# Altium schematic sheet LP55231 LED DRIVER.SchDoc
size A4; SheetNumber: 4; SheetTotal: 4
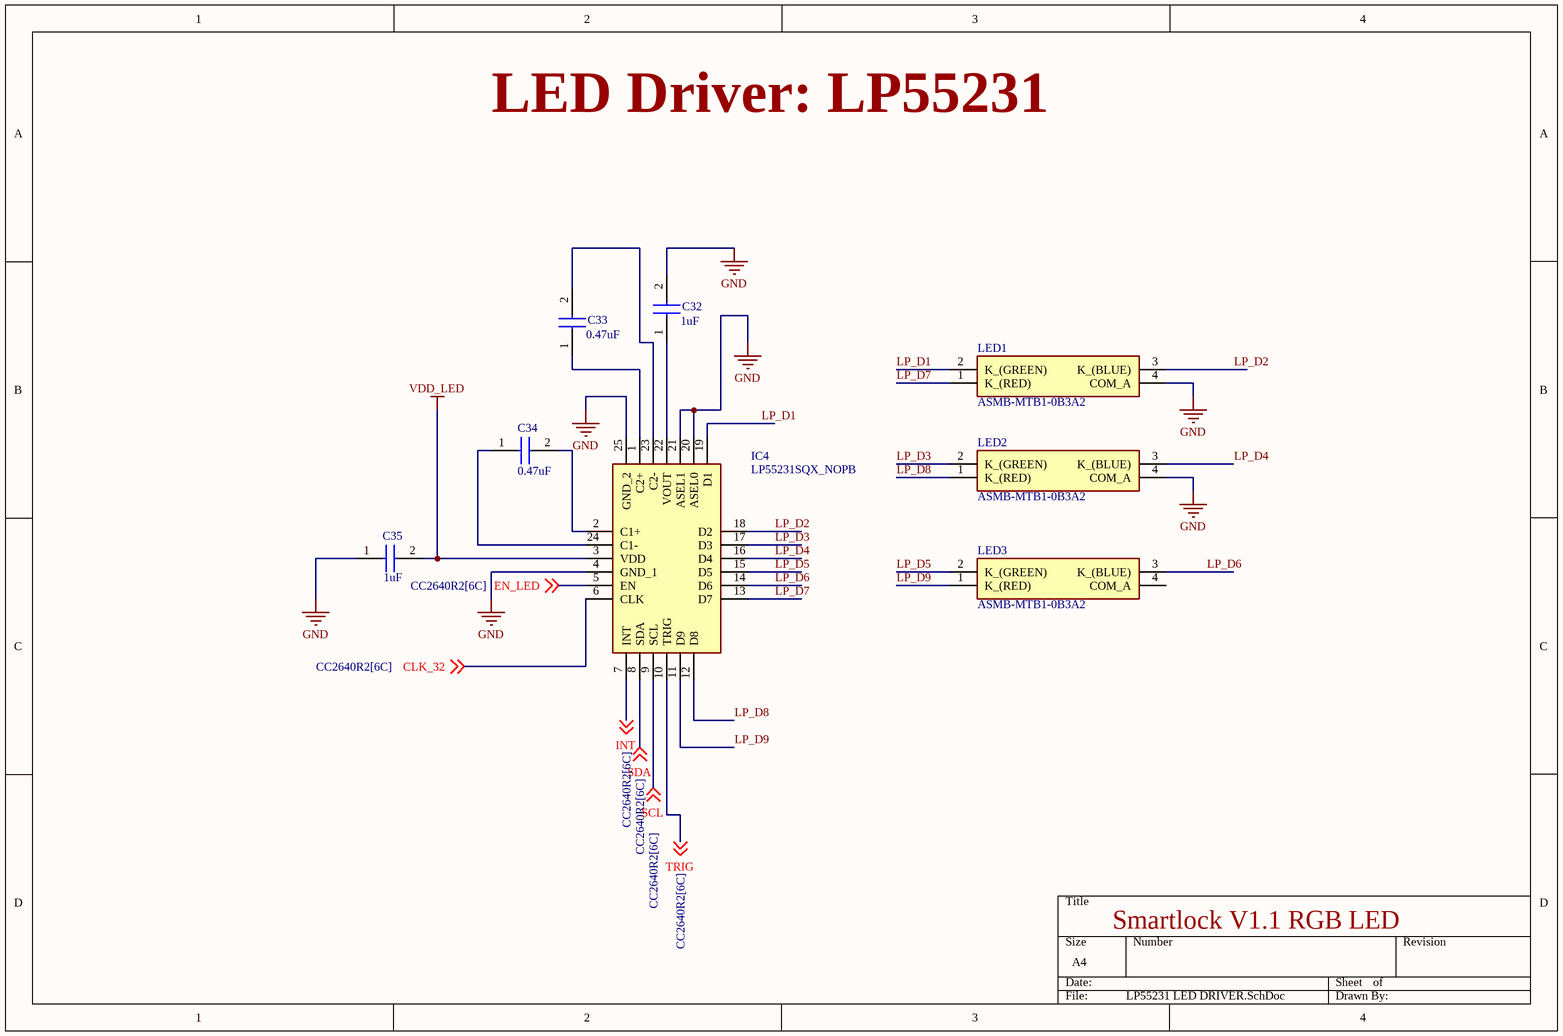
[diagram p0: LP55231 LED DRIVER.SchDoc]

## Parts
C32  1uF  [CAPC1005X55N]
C33  0.47uF  [CAPC1005X55N]
C34  0.47uF  [CAPC1005X55N]
C35  1uF  [CAPC1005X55N]
IC4  LP55231SQX_NOPB  [QFN50P400X400X80-25N]
LED1  ASMB-MTB1-0B3A2  [ASMBMTB10B3A2]
LED2  ASMB-MTB1-0B3A2  [ASMBMTB10B3A2]
LED3  ASMB-MTB1-0B3A2  [ASMBMTB10B3A2]

## Nets
GND: C32.2 C35.1 IC4.4(GND_1) IC4.20(ASEL0) IC4.21(ASEL1) IC4.25(GND_2) LED1.4(COM_A) LED2.4(COM_A)
VDD_LED: C35.2 IC4.3(VDD)
CLK_32: IC4.6(CLK) ; off-sheet CLK_32
EN_LED: IC4.5(EN) ; off-sheet EN_LED
INT: IC4.7(INT) ; off-sheet INT
LP_D1: IC4.19(D1) LED1.2(K_(GREEN))
LP_D2: IC4.18(D2) LED1.3(K_(BLUE))
LP_D3: IC4.17(D3) LED2.2(K_(GREEN))
LP_D4: IC4.16(D4) LED2.3(K_(BLUE))
LP_D5: IC4.15(D5) LED3.2(K_(GREEN))
LP_D6: IC4.14(D6) LED3.3(K_(BLUE))
LP_D7: IC4.13(D7) LED1.1(K_(RED))
LP_D8: IC4.12(D8) LED2.1(K_(RED))
LP_D9: IC4.11(D9) LED3.1(K_(RED))
SCL: IC4.9(SCL) ; off-sheet SCL
SDA: IC4.8(SDA) ; off-sheet SDA
TRIG: IC4.10(TRIG) ; off-sheet TRIG
NetC32_1: C32.1 IC4.22(VOUT)
NetC33_1: C33.1 IC4.1(C2+)
NetC33_2: C33.2 IC4.23(C2-)
NetC34_1: C34.1 IC4.24(C1-)
NetC34_2: C34.2 IC4.2(C1+)

Not connected (* = marked no-connect by the designer): LED3 4(COM_A)

## Notes on the sheet
- LED Driver: LP55231
- Smartlock V1.1 RGB LED

## Library data of the parts
C32 = GRM155R61A105KE15D: Capacitor 1uF 10V; Manufacturer_Name: Murata Electronics; Datasheet Link: http://www.murata.com/~/media/webrenewal/support/library/catalog/products/capacitor/mlcc/c02e.pdf; Height: 0.55mm; Manufacturer_Part_Number: GRM155R61A105KE15D; Mouser Part Number: 81-GRM155R61A105KE15; Mouser Price/Stock: https://www.mouser.co.uk/ProductDetail/Murata-Electronics/GRM155R61A105KE15D?qs=mjAxHPhY7UcmPekRqw%2FAPA%3D%3D; Arrow Part Number: GRM155R61A105KE15D; Arrow Price/Stock: https://www.arrow.com/en/products/grm155r61a105ke15d/murata-manufacturing?region=europe
C33 C34 = C1005X5R1A474K050BB: Capacitor 0.47uF 10V X5R; Manufacturer_Name: TDK; Datasheet Link: https://product.tdk.com/info/en/catalog/datasheets/mlcc_commercial_midvoltage_en.pdf; Height: 0.55mm; Manufacturer_Part_Number: C1005X5R1A474K050BB; Mouser Part Number: 810-C1005X5R1A474K; Mouser Price/Stock: https://www.mouser.com/Search/Refine.aspx?Keyword=810-C1005X5R1A474K
C35 = GRM155R61A105KE15D: Capacitor 1uF 10V X5R; Manufacturer_Name: Murata Electronics; Datasheet Link: http://www.murata.com/~/media/webrenewal/support/library/catalog/products/capacitor/mlcc/c02e.pdf; Height: 0.55mm; Manufacturer_Part_Number: GRM155R61A105KE15D; Mouser Part Number: 81-GRM155R61A105KE15; Mouser Price/Stock: https://www.mouser.co.uk/ProductDetail/Murata-Electronics/GRM155R61A105KE15D?qs=mjAxHPhY7UcmPekRqw%2FAPA%3D%3D; Arrow Part Number: GRM155R61A105KE15D; Arrow Price/Stock: https://www.arrow.com/en/products/grm155r61a105ke15d/murata-manufacturing?region=europe
IC4 = LP55231SQX_NOPB: Integrated Circuit; Manufacturer_Name: Texas Instruments; Manufacturer_Part_Number: LP55231SQX/NOPB; Datasheet Link: http://www.ti.com/lit/gpn/lp55231; Height: 0.8mm; Mouser Part Number: 595-LP55231SQX/NOPB; Mouser Price/Stock: https://www.mouser.co.uk/ProductDetail/Texas-Instruments/LP55231SQX-NOPB?qs=HF2YfZwisE8IcIRPR19gTw%3D%3D; Arrow Part Number: LP55231SQX/NOPB; Arrow Price/Stock: https://www.arrow.com/en/products/lp55231sqxnopb/texas-instruments?region=nac
LED1-LED3 = ASMB-MTB1-0B3A2: LED; Manufacturer_Name: Avago Technologies; Datasheet Link: https://docs.broadcom.com/doc/AV02-4194EN; Height: 2.1mm; Manufacturer_Part_Number: ASMB-MTB1-0B3A2; Mouser Part Number: 630-ASMB-MTB1-0B3A2; Mouser Price/Stock: https://www.mouser.co.uk/ProductDetail/Broadcom-Avago/ASMB-MTB1-0B3A2?qs=pUKx8fyJudDzsc2Rt%2Fv8dg%3D%3D